# EAGLE schematic melzi (EAGLE 5.11)
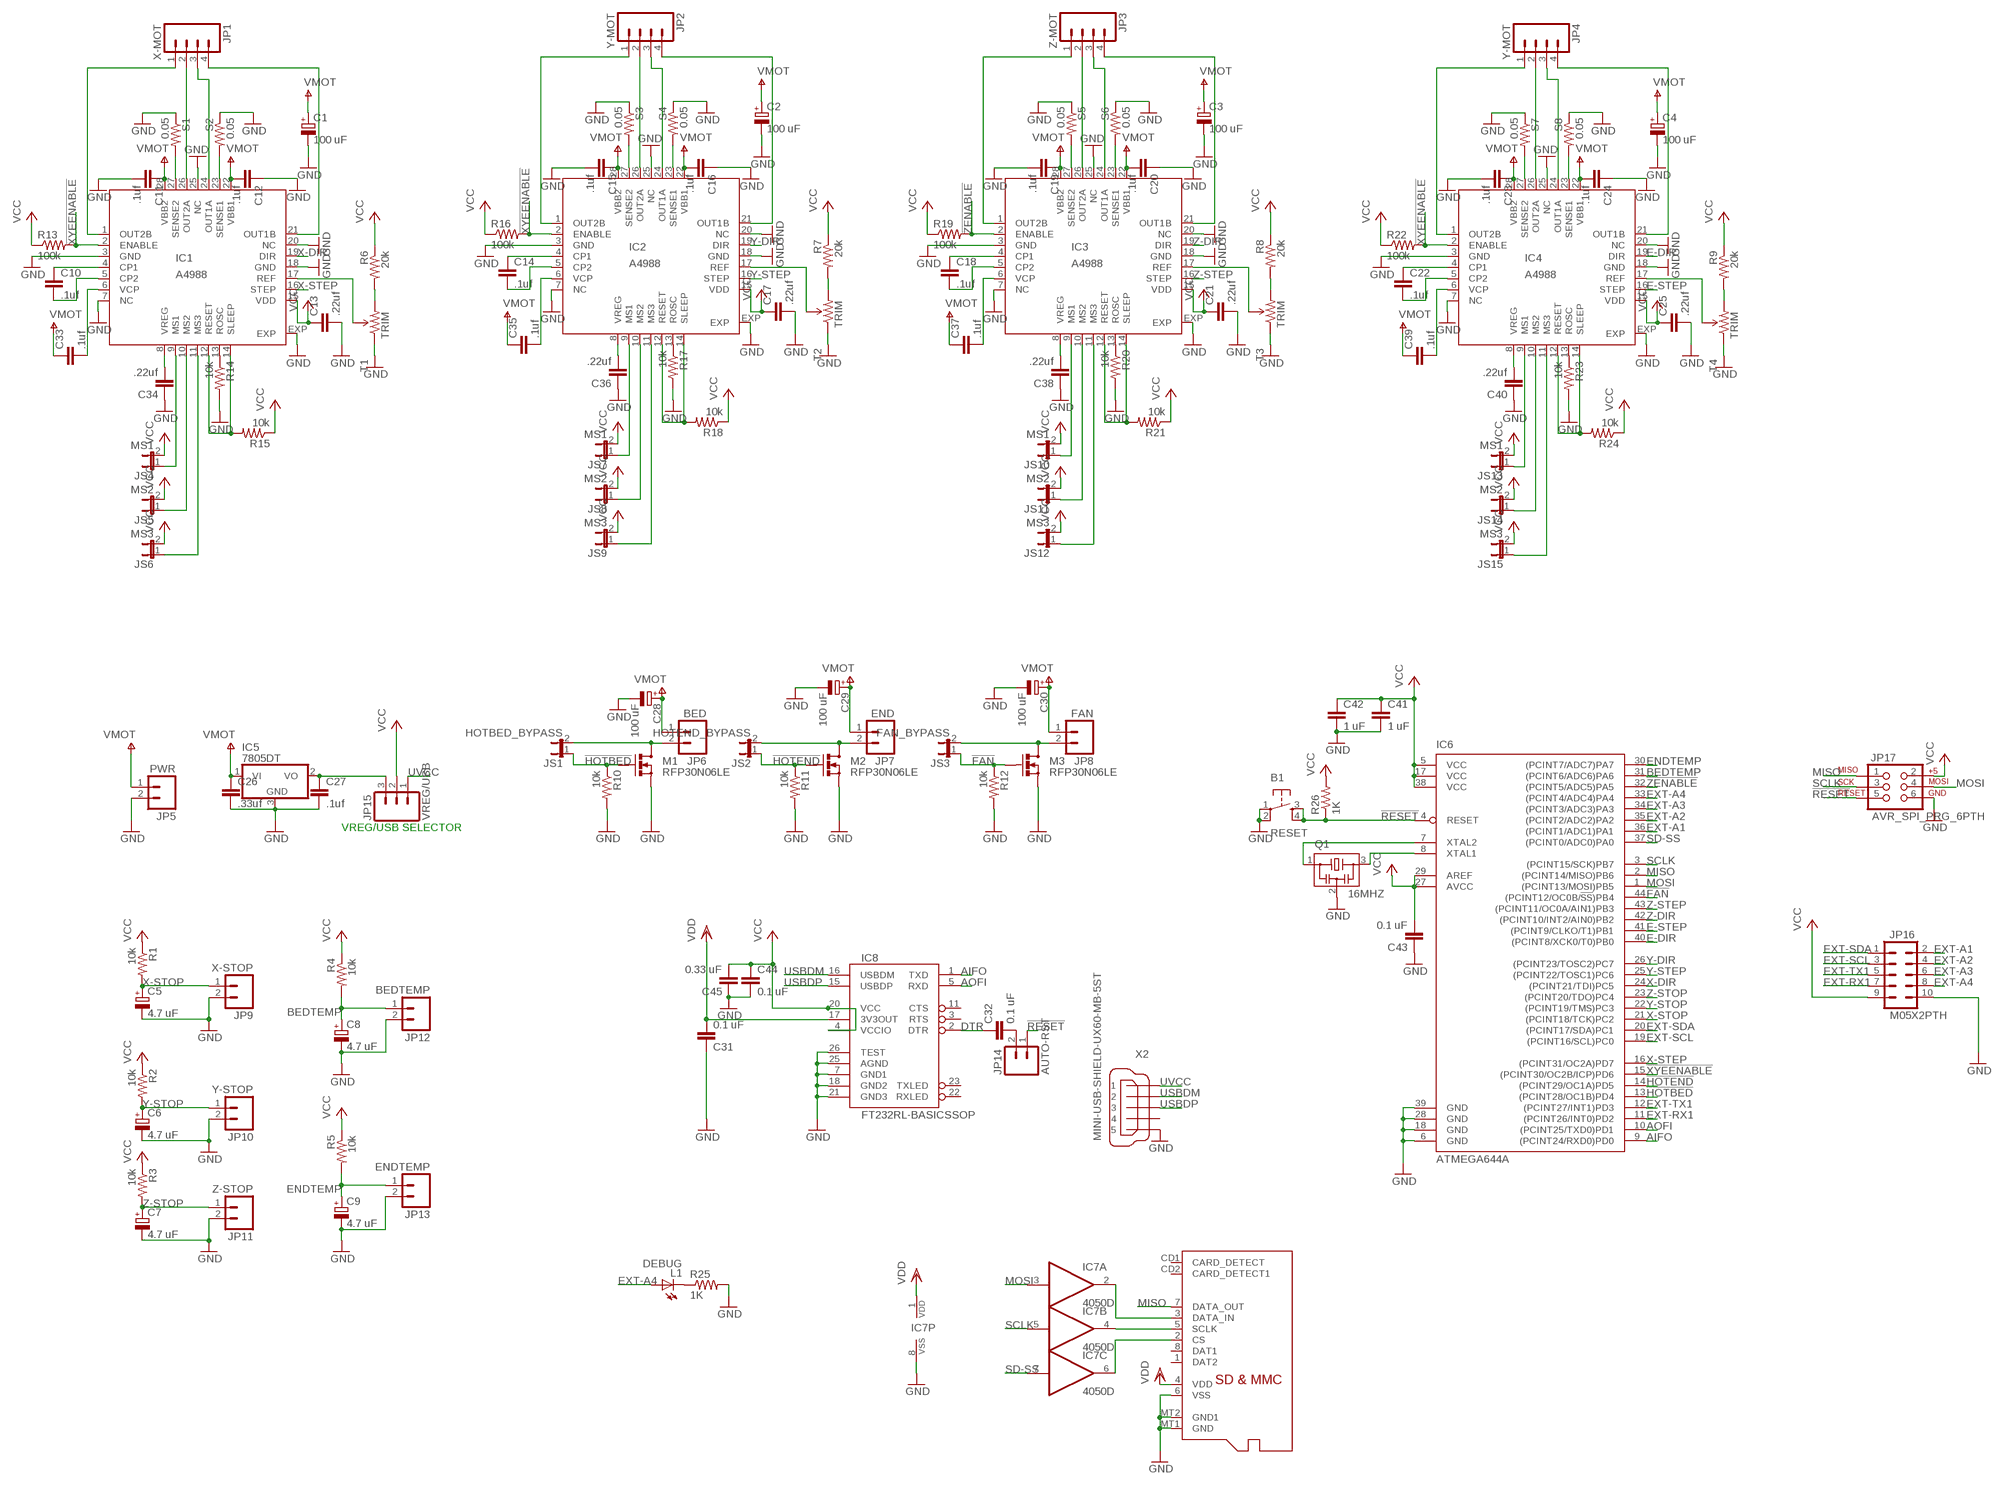
[diagram p0: schematic, sheet 1]

## Parts
B1  RESET  TAC_SWITCHSMD  [TACTILE_SWITCH_SMD]
C1  100 uF  CPOL-EUUD-6,3X7,7  [UD-6,3X7,7_NICHICON]
C2  100 uF  CPOL-EUUD-6,3X7,7  [UD-6,3X7,7_NICHICON]
C3  100 uF  CPOL-EUUD-6,3X7,7  [UD-6,3X7,7_NICHICON]
C4  100 uF  CPOL-EUUD-6,3X7,7  [UD-6,3X7,7_NICHICON]
C5  4.7 uF  CPOL-EUSMCC  [SMC_C]
C6  4.7 uF  CPOL-EUSMCC  [SMC_C]
C7  4.7 uF  CPOL-EUSMCC  [SMC_C]
C8  4.7 uF  CPOL-EUSMCC  [SMC_C]
C9  4.7 uF  CPOL-EUSMCC  [SMC_C]
C10  .1uf  CAP0805  [0805]
C11  .1uf  CAP0805  [0805]
C12  .1uf  CAP0805  [0805]
C13  .22uf  CAP0805  [0805]
C14  .1uf  CAP0805  [0805]
C15  .1uf  CAP0805  [0805]
C16  .1uf  CAP0805  [0805]
C17  .22uf  CAP0805  [0805]
C18  .1uf  CAP0805  [0805]
C19  .1uf  CAP0805  [0805]
C20  .1uf  CAP0805  [0805]
C21  .22uf  CAP0805  [0805]
C22  .1uf  CAP0805  [0805]
C23  .1uf  CAP0805  [0805]
C24  .1uf  CAP0805  [0805]
C25  .22uf  CAP0805  [0805]
C26  .33uf  CAP0805  [0805]
C27  .1uf  CAP0805  [0805]
C28  100 uF  CPOL-EUUD-6,3X7,7  [UD-6,3X7,7_NICHICON]
C29  100 uF  CPOL-EUUD-6,3X7,7  [UD-6,3X7,7_NICHICON]
C30  100 uF  CPOL-EUUD-6,3X7,7  [UD-6,3X7,7_NICHICON]
C31  0.1 uF  C-EUC1206  [C1206]
C32  0.1 uF  C-EUC1206  [C1206]
C33  .1uf  CAP0805  [0805]
C34  .22uf  CAP0805  [0805]
C35  .1uf  CAP0805  [0805]
C36  .22uf  CAP0805  [0805]
C37  .1uf  CAP0805  [0805]
C38  .22uf  CAP0805  [0805]
C39  .1uf  CAP0805  [0805]
C40  .22uf  CAP0805  [0805]
C41  1 uF  C-EUC1206  [C1206]
C42  1 uF  C-EUC1206  [C1206]
C43  0.1 uF  C-EUC1206  [C1206]
C44  0.1 uF  C-EUC1206  [C1206]
C45  0.33 uF  C-EUC1206  [C1206]
IC1  A4988  A4983  [QFN28ET]
IC2  A4988  A4983  [QFN28ET]
IC3  A4988  A4983  [QFN28ET]
IC4  A4988  A4983  [QFN28ET]
IC5  7805DT  [TO252]
IC6  ATMEGA644A  [TQFP44]
IC7  4050D  [SO16]
IC8  FT232RL-BASICSSOP  [SSOP28DB]
JP1  X-MOT  M04SCREW  [SCREWTERMINAL-3.5MM-4]
JP2  Y-MOT  M04SCREW  [SCREWTERMINAL-3.5MM-4]
JP3  Z-MOT  M04SCREW  [SCREWTERMINAL-3.5MM-4]
JP4  Y-MOT  M04SCREW  [SCREWTERMINAL-3.5MM-4]
JP5  PWR  M025MM  [SCREWTERMINAL-5MM-2]
JP6  BED  M025MM  [SCREWTERMINAL-5MM-2]
JP7  END  M025MM  [SCREWTERMINAL-5MM-2]
JP8  FAN  M025MM  [SCREWTERMINAL-5MM-2]
JP9  X-STOP  M023.5MM  [SCREWTERMINAL-3.5MM-2]
JP10  Y-STOP  M023.5MM  [SCREWTERMINAL-3.5MM-2]
JP11  Z-STOP  M023.5MM  [SCREWTERMINAL-3.5MM-2]
JP12  BEDTEMP  M023.5MM  [SCREWTERMINAL-3.5MM-2]
JP13  ENDTEMP  M023.5MM  [SCREWTERMINAL-3.5MM-2]
JP14  AUTO-RST  M02PTH  [1X02]
JP15  VREG/USB  M03PTH  [1X03]
JP16  M05X2PTH  [AVR_ICSP]
JP17  AVR_SPI_PRG_6PTH  [2X3]
JS1  HOTBED_BYPASS  JUMPER-2SMD-NO  [SJ_2S-NO]
JS2  HOTEND_BYPASS  JUMPER-2SMD-NO  [SJ_2S-NO]
JS3  FAN_BYPASS  JUMPER-2SMD-NO  [SJ_2S-NO]
JS4  MS1  JUMPER-2SMD-NC  [SJ_2S]
JS5  MS2  JUMPER-2SMD-NC  [SJ_2S]
JS6  MS3  JUMPER-2SMD-NC  [SJ_2S]
JS7  MS1  JUMPER-2SMD-NC  [SJ_2S]
JS8  MS2  JUMPER-2SMD-NC  [SJ_2S]
JS9  MS3  JUMPER-2SMD-NC  [SJ_2S]
JS10  MS1  JUMPER-2SMD-NC  [SJ_2S]
JS11  MS2  JUMPER-2SMD-NC  [SJ_2S]
JS12  MS3  JUMPER-2SMD-NC  [SJ_2S]
JS13  MS1  JUMPER-2SMD-NC  [SJ_2S]
JS14  MS2  JUMPER-2SMD-NC  [SJ_2S]
JS15  MS3  JUMPER-2SMD-NC  [SJ_2S]
L1  DEBUG  LED1206  [LED-1206]
M1  RFP30N06LE  MOSFET-NCHANNELFDD8580  [DPAK]
M2  RFP30N06LE  MOSFET-NCHANNELFDD8580  [DPAK]
M3  RFP30N06LE  MOSFET-NCHANNELFDD8580  [DPAK]
Q1  16MHZ  CSTCR6M00G53Z  [CSTCR6M]
R1  10k  RESISTOR1206  [1206]
R2  10k  RESISTOR1206  [1206]
R3  10k  RESISTOR1206  [1206]
R4  10k  RESISTOR1206  [1206]
R5  10k  RESISTOR1206  [1206]
R6  20k  RESISTOR  [0805]
R7  20k  RESISTOR  [0805]
R8  20k  RESISTOR  [0805]
R9  20k  RESISTOR  [0805]
R10  10k  RESISTOR1206  [1206]
R11  10k  RESISTOR1206  [1206]
R12  10k  RESISTOR1206  [1206]
R13  100k  RESISTOR  [0805]
R14  10k  RESISTOR  [0805]
R15  10k  RESISTOR  [0805]
R16  100k  RESISTOR  [0805]
R17  10k  RESISTOR  [0805]
R18  10k  RESISTOR  [0805]
R19  100k  RESISTOR  [0805]
R20  10k  RESISTOR  [0805]
R21  10k  RESISTOR  [0805]
R22  100k  RESISTOR  [0805]
R23  10k  RESISTOR  [0805]
R24  10k  RESISTOR  [0805]
R25  1K  RESISTOR1206  [1206]
R26  1K  RESISTOR1206  [1206]
S1  0.05  RESISTOR1206  [1206]
S2  0.05  RESISTOR1206  [1206]
S3  0.05  RESISTOR1206  [1206]
S4  0.05  RESISTOR1206  [1206]
S5  0.05  RESISTOR1206  [1206]
S6  0.05  RESISTOR1206  [1206]
S7  0.05  RESISTOR1206  [1206]
S8  0.05  RESISTOR1206  [1206]
T1  TRIM  TRIMPOTSMD  [TRIMPOT-3MM]
T2  TRIM  TRIMPOTSMD  [TRIMPOT-3MM]
T3  TRIM  TRIMPOTSMD  [TRIMPOT-3MM]
T4  TRIM  TRIMPOTSMD  [TRIMPOT-3MM]
X1  MICROSD  [MICROSD]
X2  MINI-USB-SHIELD-UX60-MB-5ST  [UX60-MB-5ST]

## Nets
!FAN: IC6.44((PCINT12/OC0B/!SS!)PB4) JS3.1 M3.1(G) R12.1
!HOTBED: IC6.13((PCINT28/OC1B)PD4) JS1.1 M1.1(G) R10.1
!HOTEND: IC6.14((PCINT29/OC1A)PD5) JS2.1 M2.1(G) R11.1
!RESET: B1.3 B1.4 IC6.4(RESET) JP14.1 JP17.5 R26.1
!XYEENABLE: IC1.2(ENABLE) IC2.2(ENABLE) IC4.2(ENABLE) IC6.15((PCINT30/OC2B/ICP)PD6) R13.2 R16.2 R22.2
!ZENABLE: IC3.2(ENABLE) IC6.32((PCINT5/ADC5)PA5) R19.2
AIFO: IC6.9((PCINT24/RXD0)PD0) IC8.1(TXD)
AOFI: IC6.10((PCINT25/TXD0)PD1) IC8.5(RXD)
BEDTEMP: C8.+ IC6.31((PCINT6/ADC6)PA6) JP12.1 R4.2
DTR: C32.1 IC8.2(DTR)
E-DIR: IC4.19(DIR) IC6.40((PCINT8/XCK0/T0)PB0)
E-STEP: IC4.16(STEP) IC6.41((PCINT9/CLKO/T1)PB1)
ENDTEMP: C9.+ IC6.30((PCINT7/ADC7)PA7) JP13.1 R5.2
EOUT1A: IC4.24(OUT1A) JP4.3
EOUT1B: IC4.21(OUT1B) JP4.4
EOUT2A: IC4.26(OUT2A) JP4.2
EOUT2B: IC4.1(OUT2B) JP4.1
EXT-A1: IC6.36((PCINT1/ADC1)PA1) JP16.2
EXT-A2: IC6.35((PCINT2/ADC2)PA2) JP16.4
EXT-A3: IC6.34((PCINT3/ADC3)PA3) JP16.6
EXT-A4: IC6.33((PCINT4/ADC4)PA4) JP16.8 L1.A
EXT-RX1: IC6.11((PCINT26/INT0)PD2) JP16.7
EXT-SCL: IC6.19((PCINT16/SCL)PC0) JP16.3
EXT-SDA: IC6.20((PCINT17/SDA)PC1) JP16.1
EXT-TX1: IC6.12((PCINT27/INT1)PD3) JP16.5
GND: B1.1 B1.2 C1.- C2.- C3.- C4.- C5.- C6.- C7.- C8.- C9.- C11.2 C12.1 C13.2 C15.2 C16.1 C17.2 C19.2 C20.1 C21.2 C23.2 C24.1 C25.2 C26.2 C27.2 C28.- C29.- C30.- C31.1 C34.1 C36.1 C38.1 C40.1 C41.2 C42.2 C43.1 C44.2 C45.1 IC1.3(GND) IC1.7(NC) IC1.18(GND) IC1.20(NC) IC1.25(NC) IC1.EXP IC2.3(GND) IC2.7(NC) IC2.18(GND) IC2.20(NC) IC2.25(NC) IC2.EXP IC3.3(GND) IC3.7(NC) IC3.18(GND) IC3.20(NC) IC3.25(NC) IC3.EXP IC4.3(GND) IC4.7(NC) IC4.18(GND) IC4.20(NC) IC4.25(NC) IC4.EXP IC5.3(GND) IC6.6(GND) IC6.18(GND) IC6.28(GND) IC6.39(GND) IC7.8(P:VSS) IC8.7(GND1) IC8.18(GND2) IC8.21(GND3) IC8.25(AGND) IC8.26(TEST) JP5.2 JP9.2 JP10.2 JP11.2 JP12.2 JP13.2 JP16.10 JP17.6 M1.3(S) M2.3(S) M3.3(S) Q1.2 R10.2 R11.2 R12.2 R14.2 R17.2 R20.2 R23.2 R25.2 S1.1 S2.1 S3.1 S4.1 S5.1 S6.1 S7.1 S8.1 T1.1(CCW) T2.1(CCW) T3.1(CCW) T4.1(CCW) X1.6(VSS) X1.MT1(GND) X1.MT2(GND1) X2.5
HOTBED-GND [power]: JP6.2 JS1.2 M1.4(D)
HOTBED-GND1 [power]: JP7.2 JS2.2 M2.4(D)
HOTBED-GND2 [power]: JP8.2 JS3.2 M3.4(D)
MISO: IC6.2((PCINT14/MISO)PB6) JP17.1 X1.7(DATA_OUT)
MOSI: IC6.1((PCINT13/MOSI)PB5) IC7.3(A:I) JP17.4
N$2: L1.C R25.1
N$3: IC1.9(MS1) JS4.1
N$11: IC2.10(MS2) JS8.1
N$12: IC7.2(A:O) X1.3(DATA_IN)
N$13: IC7.4(B:O) X1.5(SCLK)
N$14: IC7.6(C:O) X1.2(CS)
N$15: C27.1 IC5.2(VO) JP15.3
N$16: IC2.11(MS3) JS9.1
N$17: IC2.9(MS1) JS7.1
N$18: IC1.11(MS3) JS6.1
N$19: IC1.10(MS2) JS5.1
N$20: IC3.9(MS1) JS10.1
N$21: IC3.10(MS2) JS11.1
N$22: IC3.11(MS3) JS12.1
N$24: IC4.10(MS2) JS14.1
N$25: IC4.11(MS3) JS15.1
N$26: C32.2 JP14.2
N$27: IC4.9(MS1) JS13.1
N$28: IC6.7(XTAL2) Q1.1
N$29: IC6.8(XTAL1) Q1.3
SCLK: IC6.3((PCINT15/SCK)PB7) IC7.5(B:I) JP17.3
SD-SS: IC6.37((PCINT0/ADC0)PA0) IC7.7(C:I)
USBDM: IC8.16(USBDM) X2.2
USBDP: IC8.15(USBDP) X2.3
UVCC [input]: JP15.1 X2.1
VCC [power]: C13.1 C17.1 C21.1 C25.1 C41.1 C42.1 C43.2 C44.1 C45.2 IC1.15(VDD) IC2.15(VDD) IC3.15(VDD) IC4.15(VDD) IC6.5(VCC) IC6.17(VCC) IC6.27(AVCC) IC6.29(AREF) IC6.38(VCC) IC8.4(VCCIO) IC8.20(VCC) JP15.2 JP16.9 JP17.2 JS4.2 JS5.2 JS6.2 JS7.2 JS8.2 JS9.2 JS10.2 JS11.2 JS12.2 JS13.2 JS14.2 JS15.2 R1.1 R2.1 R3.1 R4.1 R5.1 R6.1 R7.1 R8.1 R9.1 R13.1 R15.1 R16.1 R18.1 R19.1 R21.1 R22.1 R24.1 R26.2
VDD: C31.2 IC7.1(P:VDD) IC8.17(3V3OUT) X1.4(VDD)
VMOT: C1.+ C2.+ C3.+ C4.+ C11.1 C12.2 C15.1 C16.2 C19.1 C20.2 C23.1 C24.2 C26.1 C28.+ C29.+ C30.+ C33.1 C35.1 C37.1 C39.1 IC1.22(VBB1) IC1.28(VBB2) IC2.22(VBB1) IC2.28(VBB2) IC3.22(VBB1) IC3.28(VBB2) IC4.22(VBB1) IC4.28(VBB2) IC5.1(VI) JP5.1 JP6.1 JP7.1 JP8.1
X-DIR: IC1.19(DIR) IC6.24((PCINT21/TDI)PC5)
X-STEP: IC1.16(STEP) IC6.16((PCINT31/OC2A)PD7)
X-STOP: C5.+ IC6.21((PCINT18/TCK)PC2) JP9.1 R1.2
XCP1: C10.1 IC1.4(CP1)
XCP2: C10.2 IC1.5(CP2)
XCP3: C14.1 IC2.4(CP1)
XCP4: C14.2 IC2.5(CP2)
XCP5: C18.1 IC3.4(CP1)
XCP6: C18.2 IC3.5(CP2)
XCP7: C22.1 IC4.4(CP1)
XCP8: C22.2 IC4.5(CP2)
XOUT1A: IC1.24(OUT1A) JP1.3
XOUT1B: IC1.21(OUT1B) JP1.4
XOUT2A: IC1.26(OUT2A) JP1.2
XOUT2B: IC1.1(OUT2B) JP1.1
XREF: IC1.17(REF) T1.2(WIPER)
XREF1: IC2.17(REF) T2.2(WIPER)
XREF2: R6.2 T1.3(CW)
XREF3: R7.2 T2.3(CW)
XREF4: IC3.17(REF) T3.2(WIPER)
XREF5: R8.2 T3.3(CW)
XREF6: IC4.17(REF) T4.2(WIPER)
XREF7: R9.2 T4.3(CW)
XROSC: IC1.13(ROSC) R14.1
XROSC1: IC2.13(ROSC) R17.1
XROSC2: IC3.13(ROSC) R20.1
XROSC3: IC4.13(ROSC) R23.1
XSENSE1: IC1.23(SENSE1) S2.2
XSENSE2: IC1.27(SENSE2) S1.2
XSENSE3: IC2.27(SENSE2) S3.2
XSENSE4: IC2.23(SENSE1) S4.2
XSENSE5: IC3.27(SENSE2) S5.2
XSENSE6: IC3.23(SENSE1) S6.2
XSENSE7: IC4.27(SENSE2) S7.2
XSENSE8: IC4.23(SENSE1) S8.2
XSLEEP: IC1.12(RESET) IC1.14(SLEEP) R15.2
XSLEEP1: IC2.12(RESET) IC2.14(SLEEP) R18.2
XSLEEP2: IC3.12(RESET) IC3.14(SLEEP) R21.2
XSLEEP3: IC4.12(RESET) IC4.14(SLEEP) R24.2
XVCP: C33.2 IC1.6(VCP)
XVCP1: C35.2 IC2.6(VCP)
XVCP2: C37.2 IC3.6(VCP)
XVCP3: C39.2 IC4.6(VCP)
XVREG: C34.2 IC1.8(VREG)
XVREG1: C36.2 IC2.8(VREG)
XVREG2: C38.2 IC3.8(VREG)
XVREG3: C40.2 IC4.8(VREG)
Y-DIR: IC2.19(DIR) IC6.26((PCINT23/TOSC2)PC7)
Y-STEP: IC2.16(STEP) IC6.25((PCINT22/TOSC1)PC6)
Y-STOP: C6.+ IC6.22((PCINT19/TMS)PC3) JP10.1 R2.2
YOUT1A: IC2.24(OUT1A) JP2.3
YOUT1B: IC2.21(OUT1B) JP2.4
YOUT2A: IC2.26(OUT2A) JP2.2
YOUT2B: IC2.1(OUT2B) JP2.1
Z-DIR: IC3.19(DIR) IC6.42((PCINT10/INT2/AIN0)PB2)
Z-STEP: IC3.16(STEP) IC6.43((PCINT11/OC0A/AIN1)PB3)
Z-STOP: C7.+ IC6.23((PCINT20/TDO)PC4) JP11.1 R3.2
ZOUT1A: IC3.24(OUT1A) JP3.3
ZOUT1B: IC3.21(OUT1B) JP3.4
ZOUT2A: IC3.26(OUT2A) JP3.2
ZOUT2B: IC3.1(OUT2B) JP3.1
Unconnected: IC7.9(D:I) IC7.10(D:O) IC7.11(E:I) IC7.12(E:O) IC7.14(F:I) IC7.15(F:O) IC8.3(RTS) IC8.11(CTS) IC8.22(RXLED) IC8.23(TXLED) X1.1(DAT2) X1.8(DAT1) X1.CD1(CARD_DETECT) X1.CD2(CARD_DETECT1) X2.4 X2.M1(S1) X2.M2(S2) X2.M3(S3) X2.M4(S4)

## Notes on the sheet
- VREG/USB SELECTOR

## Library data of the parts
B1 = SparkFun:TAC_SWITCH: Momentary Switch Button commonly used for reset or general input. Spark Fun Electronics SKU : COM-00097
C1-C9 C28-C30 = rcl:CPOL-EU: POLARIZED CAPACITOR, European symbol
C10-C27 C33-C40 = SparkFun:CAP: Capacitor Standard 0603 ceramic capacitor, and 0.1" leaded capacitor.
C31 C32 C41-C45 = rcl:C-EU: CAPACITOR, European symbol
IC1-IC4 = allegro:A4983: DMOS Microstepping Driver with Translator Auto generated by make-symbol-device-package-bsdl.ulp Rev. 32 Source: http://www.allegromicro.com/en/Products/Part_Numbers/4983/4983.pdf; MPN: A4983SETTR-T; OC_FARNELL: 1688956; OC_NEWARK: 39M6763
IC5 = linear:78*: Positive VOLTAGE REGULATOR Source: http://cache.national.com/ds/LM/LM78L05.pdf http://www.fairchildsemi.com/ds/LM/LM7805.pdf
IC6 = atmel:ATMEGA644: 8-bit Microcontroller with 64K Bytes In-System Programmable Flash Source: http://www.atmel.com/dyn/resources/prod_documents/doc2593.pdf; MPN: ATMEGA644PV-10AU; OC_FARNELL: 1455123; OC_NEWARK: 58M3748
IC7 = 40xx:4050: Hex non-inverting BUFFER
IC8 = SparkFun:FT232RL-BASIC: USB UART This is the simplified version of the FT232RL unit. Only what you need, nothing you don't. Spark Fun Electronics SKU : COM-00650
JP1-JP4 = SparkFun:M04: Header 4 Standard 4-pin 0.1" header. Use with straight break away headers (SKU : PRT-00116), right angle break away headers (PRT-00553), swiss pins (PRT-00743), machine pins (PRT-00117), and female headers (PRT-00115). Molex polarized connector foot print use with SKU : PRT-08231 with associated crimp pins and housings.
JP5-JP14 = SparkFun:M02: Header 2 Standard 2-pin 0.1" header. Use with straight break away headers (SKU : PRT-00116), right angle break away headers (PRT-00553), swiss pins (PRT-00743), machine pins (PRT-00117), and female headers (PRT-00115). Molex polarized connector foot print use with SKU : PRT-08233 with associated crimp pins and housings.
JP15 = SparkFun:M03: Header 3 Standard 3-pin 0.1" header. Use with straight break away headers (SKU : PRT-00116), right angle break away headers (PRT-00553), swiss pins (PRT-00743), machine pins (PRT-00117), and female headers (PRT-00115). Molex polarized connector foot print use with SKU : PRT-08232 with associated crimp pins and housings.
JP16 = SparkFun:M05X2: Header 5x2 Standard 10-pin dual row 0.1" header. Commonly used with AVR-ISP. Use with Spark Fun Electronics SKU: PRT-00778
JP17 = SparkFun:AVR_SPI_PRG_6: AVR ISP 6 Pin This is the reduced ISP connector for AVR programming. Common on Arduino. This footprint will take up less PCB space and can be used with a 10-pin to 6-pin adapter such as SKU: BOB-08508
JS1-JS15 = SparkFun:JUMPER-2: Jumper Basic 0.1" spaced jumper. Use with breakaway headers.
L1 = SparkFun:LED: LEDs Standard schematic elements and footprints for 5mm, 3mm, 1206, and 0603 sized LEDs. 5mm - Spark Fun Electronics SKU : COM-00529 (and others)
M1-M3 = SparkFun:MOSFET-NCHANNEL
Q1 = murata-filter:CSTCR: Resonator Source: murata.co.jp; MPN: CSTCR6M00G53-R0; OC_FARNELL: 1170434; OC_NEWARK: 25M8759
R1-R26 S1-S8 = SparkFun:RESISTOR: Resistor Basic schematic elements and footprints for 0603, 1206, and PTH 1/10th watt (small) resistors.
T1-T4 = SparkFun:TRIMPOT
X1 = adafruit:MICROSD: Micro-SD / Transflash card holder with SPI pinout For the 3M # 2908-05WB-MG and/or 4UCON #19656 push-push type
X2 = con-hirose:MINI-USB-SHIELD-: MINI USB Connector Source: http://www.hirose.co.jp/cataloge_hp/e24000019.pdf; OC_FARNELL: unknown; OC_NEWARK: unknown